# Altium schematic sheet Programming.SchDoc
size A4
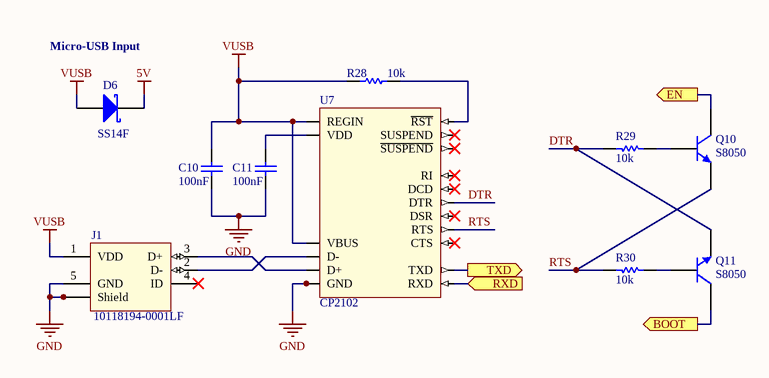
[diagram p0: Programming.SchDoc]

## Parts
C10  value 100nF  [J1-0603]  (hidden comment: Cap)
C11  value 100nF  [J1-0603]  (hidden comment: Cap)
D6  SS14F  [SS14]
J1  10118194-0001LF  [10103594-0001LF]
Q10  S8050  [SOT23-3M]
Q11  S8050  [SOT23-3M]
R28  value 10k  [J1-0603]  (hidden comment: Res1)
R29  value 10k  [J1-0603]  (hidden comment: Res1)
R30  value 10k  [J1-0603]  (hidden comment: Res1)
U7  CP2102  [QFN-28]

## Ports
BOOT (out), EN (out), RXD (in), TXD (out)

## Nets
5V: D6.2(K)
GND: C10.1 C11.1 J1.5(GND) J1.6(Shield) J1.7(Shield) J1.8(Shield) J1.9(Shield) U7.3(GND) U7.29
VUSB: C10.2 D6.1(A) J1.1(VDD) R28.2 U7.7(REGIN) U7.8(VBUS)
BOOT: Q11.3(C) ; port BOOT
DTR: Q11.2(E) R29.1 U7.28(DTR)
EN: Q10.3(C) ; port EN
RTS: Q10.2(E) R30.1 U7.24(RTS)
RXD: U7.25(RXD) ; port RXD
TXD: U7.26(TXD) ; port TXD
NetC11_2: C11.2 U7.6(VDD)
NetJ1_2: J1.2(D-) U7.5(D-)
NetJ1_3: J1.3(D+) U7.4(D+)
NetQ10_1: Q10.1(B) R29.2
NetQ11_1: Q11.1(B) R30.2
NetR28_1: R28.1 U7.9(~{RST})

Not connected (* = marked no-connect by the designer): J1 4(ID)*; U7 1(DCD)* 2(RI)* 11(~{SUSPEND})* 12(SUSPEND)* 23(CTS)* 27(DSR)*

## Notes on the sheet
- Micro-USB Input

## Library data of the parts
C10 C11 = Cap: Capacitor; Published: 8-Jun-2000; LatestRevisionDate: 17-Jul-2002; LatestRevisionNote: Re-released for DXP Platform.; PackageReference: RAD-0.3; Publisher: Altium Limited; PackageDescription: Radial Cap, Thru-Hole; 2 Leads; 0.3 in Pin Spacing; LCSC: C153795
D6 = D Schottky: Schottky Diode; Published: 8-Jun-2000; LatestRevisionDate: 17-Jul-2002; LatestRevisionNote: Re-released for DXP Platform.; PackageReference: SMB; Publisher: Altium Limited; PackageDescription: DO-214-AA/SMB; 2 C-Bend Leads; Body 5.3 x 3.6 mm, inc. leads (LxW); Code_JEDEC: DO-214-AA; LCSC: C110213
J1 = 10118194-0001LF_1: Conn Micro USB Type B RCP 5 POS 0.65mm Solder RA SMD 5 Terminal 1 Port T/R; MF: FCI; RS: 714-2347; Availability: Good; Price: 0.23 USD; MP: 10118194-0001LF; Package: DIP-4 FCI; Value: *
Q10 Q11 = S8050: NPN General Purpose Amplifier; Published: 8-Jun-2000; LatestRevisionDate: 15-Jan-2003; LatestRevisionNote: PCB Footprint 'BCY-W3/D4.7' replaced; DatasheetVersion: 1997; PackageVersion: Sep-1998; PackageReference: TO-92A; Publisher: Altium Limited; PackageDescription: TO, Flat Index; 3 In-Line, Axial Leads; Body Dia. 4.5mm; Leads 0.51 x 0.48 mm (max); LCSC: C259988
R28-R30 = Res1: Resistor; Published: 8-Jun-2000; LatestRevisionDate: 17-Jul-2002; LatestRevisionNote: Re-released for DXP Platform.; PackageReference: AXIAL-0.3; Publisher: Altium Limited; PackageDescription: Axial Device, Thru-Hole; 2 Leads; 0.3 in Pin Spacing